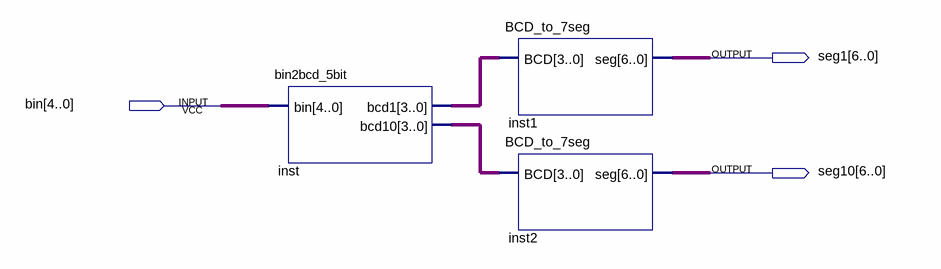
[diagram p0: schematic sheet]
// Quartus schematic bin2seg5bit.bdf as structural Verilog: 3 symbols, 3 pins
module bin2seg5bit (
  input  [4:0] bin,
  output [6:0] seg1,
  output [6:0] seg10
);

  wire [3:0] inst_bcd1, inst_bcd10;

  bin2bcd_5bit inst (.bin(bin), .bcd1(inst_bcd1), .bcd10(inst_bcd10));
  BCD_to_7seg inst1 (.BCD(inst_bcd1), .seg(seg1));
  BCD_to_7seg inst2 (.BCD(inst_bcd10), .seg(seg10));
endmodule
